# Altium schematic sheet BatteryConn&Protection.SchDoc
size A; DocumentNumber: 3; SheetNumber: 3; SheetTotal: 7
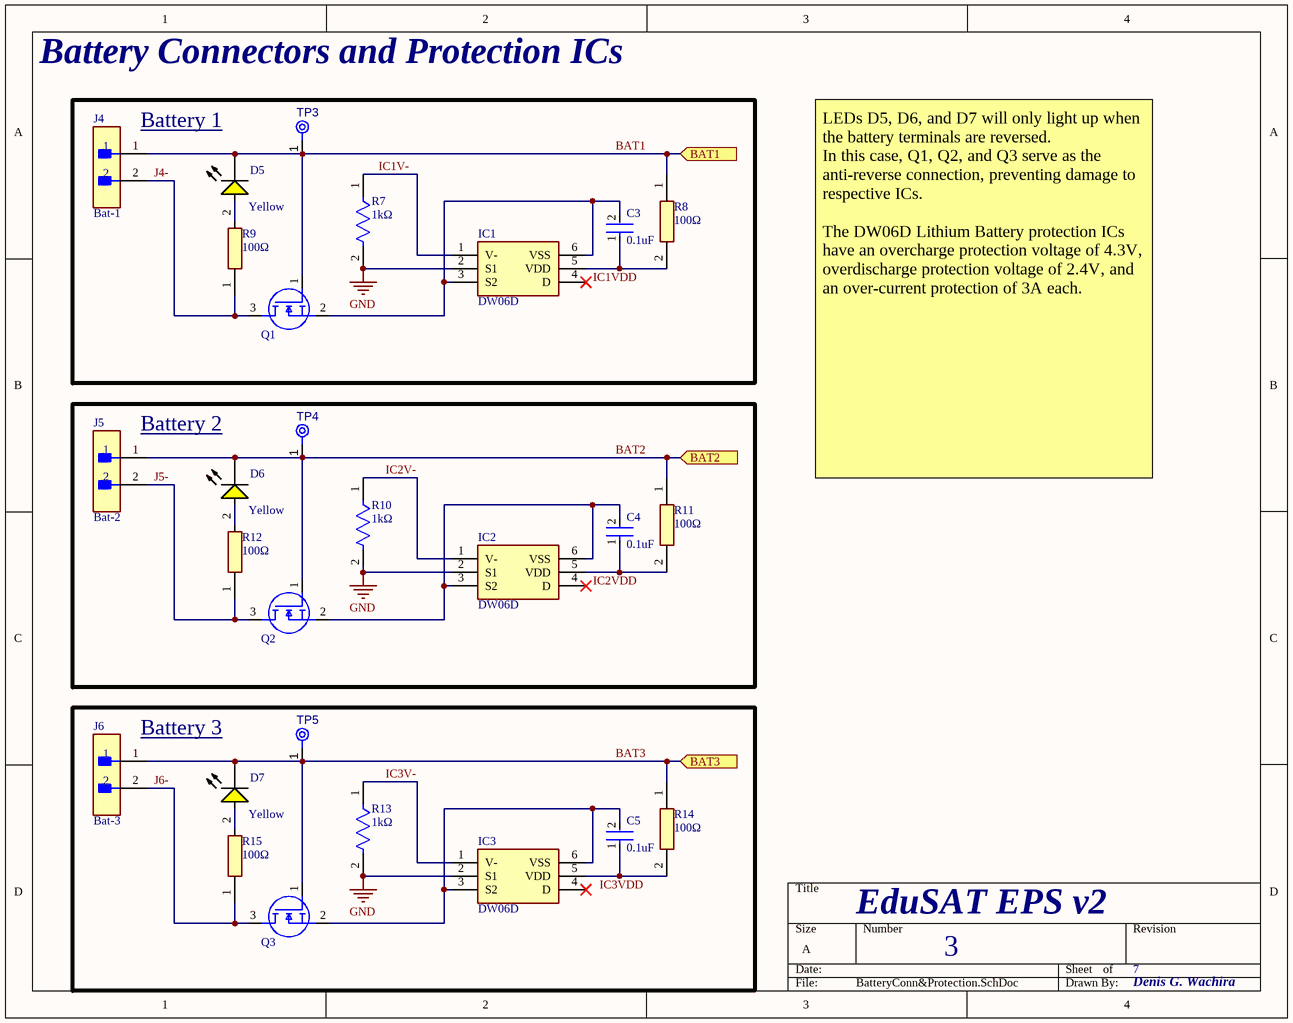
[diagram p0: BatteryConn&Protection.SchDoc]

## Parts
C3  0.1uF  [FP-CL21-IPC_A]
C4  0.1uF  [FP-CL21-IPC_A]
C5  0.1uF  [FP-CL21-IPC_A]
D5  Yellow  [LTST-C170KSKT_V]
D6  Yellow  [LTST-C170KSKT_V]
D7  Yellow  [LTST-C170KSKT_V]
IC1  DW06D  [SOT95P280X135-6N]
IC2  DW06D  [SOT95P280X135-6N]
IC3  DW06D  [SOT95P280X135-6N]
J4  Bat-1  [FP-S2B-XH-A-1_LF_SN-MFG]
J5  Bat-2  [FP-S2B-XH-A-1_LF_SN-MFG]
J6  Bat-3  [FP-S2B-XH-A-1_LF_SN-MFG]
Q1  (no value)  [SOT95P237X112-3N]
Q2  (no value)  [SOT95P237X112-3N]
Q3  (no value)  [SOT95P237X112-3N]
R7  1kΩ  [FP-MCR10-IPC_A]
R8  100Ω  [RESC2012X65N]
R9  100Ω  [RESC2012X65N]
R10  1kΩ  [FP-MCR10-IPC_A]
R11  100Ω  [RESC2012X65N]
R12  100Ω  [RESC2012X65N]
R13  1kΩ  [FP-MCR10-IPC_A]
R14  100Ω  [RESC2012X65N]
R15  100Ω  [RESC2012X65N]
TP3  TPAD6R  [TP06R]  (value not drawn)  (no BOM)
TP4  TPAD6R  [TP06R]  (value not drawn)  (no BOM)
TP5  TPAD6R  [TP06R]  (value not drawn)  (no BOM)

## Blocks framed on the sheet
Battery 1: C3 D5 IC1 J4 Q1 R7-R9 TP3
Battery 2: C4 D6 IC2 J5 Q2 R10-R12 TP4
Battery 3: C5 D7 IC3 J6 Q3 R13-R15 TP5

## Ports
BAT1 (in, see EduSAT-EPSv2[3B], Charging&1AOut1[4B]), BAT2 (in, see EduSAT-EPSv2[3C], Charging&1AOut2[4B]), BAT3 (in, see EduSAT-EPSv2[3C], Charging&1AOut3[4B])

## Nets
GND: IC1.2(S1) IC2.2(S1) IC3.2(S1) R7.2 R10.2 R13.2
BAT1: D5.2(K) J4.1 Q1.1(G) R8.1 TP3.1(TP) ; port BAT1
BAT2: D6.2(K) J5.1 Q2.1(G) R11.1 TP4.1(TP) ; port BAT2
BAT3: D7.2(K) J6.1 Q3.1(G) R14.1 TP5.1(TP) ; port BAT3
IC1V-: IC1.1(V-) R7.1
IC1VDD: C3.1 IC1.5(VDD) R8.2
IC2V-: IC2.1(V-) R10.1
IC2VDD: C4.1 IC2.5(VDD) R11.2
IC3V-: IC3.1(V-) R13.1
IC3VDD: C5.1 IC3.5(VDD) R14.2
J4-: J4.2 Q1.3(D) R9.1
J5-: J5.2 Q2.3(D) R12.1
J6-: J6.2 Q3.3(D) R15.1
NetC3_2: C3.2 IC1.3(S2) IC1.6(VSS) Q1.2(S)
NetC4_2: C4.2 IC2.3(S2) IC2.6(VSS) Q2.2(S)
NetC5_2: C5.2 IC3.3(S2) IC3.6(VSS) Q3.2(S)
NetD5_1: D5.1(A) R9.2
NetD6_1: D6.1(A) R12.2
NetD7_1: D7.1(A) R15.2

Not connected (* = marked no-connect by the designer): IC1 4(D)*; IC2 4(D)*; IC3 4(D)*

## Notes on the sheet
- Battery Connectors and Protection ICs
- LEDs D5, D6, and D7 will only light up when the battery terminals are reversed.
  In this case, Q1, Q2, and Q3 serve as the anti-reverse connection, preventing damage to respective ICs.
  The DW06D Lithium Battery protection ICs have an overcharge protection voltage of 4.3V, overdischarge protection voltage of 2.4V, and an over-current protection of 3A each.
- EduSAT EPS v2
- Denis G. Wachira

## Library data of the parts
C3-C5 = CMP-13271-002975-1: 50V 0.1uF X7R ±10% 0805 Multilayer Ceramic Capacitors MLCC - SMD/SMT ROHS TCC0805X7R104K500DT; Case Code (Imperial): 0805; Length: 2mm; Case/Package: 0805; Packaging: Tape and Reel; Width: 0.049inch; Tolerance: 10%; Mount: Surface Mount; Min Operating Temperature: -55°C; Thickness: 0.057inch; Height: 1.25mm; Dielectric: X7R; Package Quantity: 1; Depth: 1.25mm; Capacitance: 0.1uF; Voltage Rating: 50V; Case Code (Metric): 2012; Max Operating Temperature: 85°C; Radiation Hardening: No
D5-D7 = CMP-2000-06621-1: LED Yellow, 75 mW, 80 mA, -55 to 85 degC, 2-Pin SMD, RoHS, Tape and Reel KT-0805Y; Manufacturer: Lite-On; Main Category: ChipLED; Product Depth (mm): 1.25mm; Dominant Wave Length: 587nm; Viewing Angle: 130deg; Luminous Intensity: 112mcd; Test Current (It): 20mA; Emitting Color: Amber; Chip Material: AlGaInP; Product Height (mm): 1.1mm; Forward Voltage: 2.4V; High Brightness: Yes; Forward Current: 30mA; Number of  Elements: 1; Power Dissipation: 75W; Type: Uni-Color; Shape Type: Rectangular; Peak Wavelength: 588nm; Reverse Voltage: 5V; Rad Hardened: No; Product Length (mm): 2mm; DELETED: Compliant; Package Description: 2-Pin Surface Mount Device, Body 2 x 1.25 mm; Mounting: SurfaceMount; Lum Intensity: 112mcd; Pin Count: 2; Mounting Technology: SurfaceMount; Package Reference: C170KSKT; Datasheet Version: Rev. H, 04/2014; Package Type: ChipLed; Packaging: TapeandReel; Manufacturer URL: http://www.us.liteon.com/; Datasheet URL: http://optoelectronics.liteon.com/upload/download/DS-22-99-0188/S_110_LTST-C170KSKT.pdf; Operating Temp Range: -55Cto85C; Lens Dimensions: 1.4x1.25x0.6mm; Operating Temperature Classification: Industrial
IC1-IC3 = DW06D: Integrated Circuit; Manufacturer_Name: SHEN ZHEN FINE MAD ELECTRONICS GROUP; Datasheet Link: https://datasheet.lcsc.com/szlcsc/Shenzhen-Fuman-Elec-DW06D_C82123.pdf; Height: 1.35mm; Manufacturer_Part_Number: DW06D
J4-J6 = CMP-17439-000260-1: CONN HEADER R/A 2POS 2.5MM HCZZ0139-2; Voltage Rating: 250V; Number of Positions: 2; Contact Material: Brass; Series: XH; Contact Finish - Mating: TIN; Max Operating Temperature: 85°C; Number of Rows: 1; Packaging: Bulk; Insulation Color: Natural; Lead Free: Lead Free; Fastening Type: Detent; Termination: Press-Fit; Connector Type: Header; Insulation Material: Nylon; Contact Shape: Square; Contact Type: Male Pin; Mount: Through Hole; Min Operating Temperature: -25°C; Flammability Rating: UL94 V-0
Q1-Q3 = IRLML6344TRPBF: MOSFET (N-Channel)IRLML6344TRPBF; Manufacturer_Name: Infineon; Datasheet Link: https://www.infineon.com/dgdl/irlml6344pbf.pdf?fileId=5546d462533600a4015356689c44262c; Height: 1.12mm; Manufacturer_Part_Number: IRLML6344TRPBF; Mouser Part Number: 942-IRLML6344TRPBF; Mouser Price/Stock: https://www.mouser.co.uk/ProductDetail/Infineon-Technologies/IRLML6344TRPBF?qs=9%252BKlkBgLFf2w4qS48UOXVw%3D%3D; Arrow Part Number: IRLML6344TRPBF; Arrow Price/Stock: https://www.arrow.com/en/products/irlml6344trpbf/infineon-technologies-ag?region=europe
R7 R10 R13 = CMP-08839-023103-1: Thick Film Chip Resistor, 0805, 1kΩ, 1%, 100ppm/°C, 0.125W, 150V 0805W8F1001T5E; Power Rating: 125mW; Resistance: 1kR; Max Operating Temperature: 155°C; Length: 0.079inch; Case/Package: 0805; Tolerance: 1%; Mount: Surface Mount; Packaging: Tape and Reel; Number of Terminations: 2; Voltage Rating (DC): 150V; RoHS Compliant: Yes; Case Code (Metric): 2012; Lead Free: Lead Free; Max Power Dissipation: 125mW; Height: 0.024inch; Temperature Coefficient: 100ppm/°C; Resistor Type: Thick Film; Case Code (Imperial): 0805; Package Quantity: 5000; Contact Plating: Tin; Width: 0.049inch; Min Operating Temperature: -55°C
R8 R9 = AECR0805F27R0K9: 125mW Thick Film Resistors 150V ±100ppm/℃ ±1% 100Ω 0805 Chip Resistor - Surface Mount ROHS AECR0805F100RK9; Manufacturer_Name: ResistorToday; Datasheet Link: https://datasheet.lcsc.com/lcsc/2304140030_RESI-AECR0805F27R0K9_C352233.pdf; Height: 0.65mm; Manufacturer_Part_Number: AECR0805F27R0K9
R11 R12 R14 R15 = AECR0805F27R0K9: 125mW Thick Film Resistors 150V ±100ppm/℃ ±1% 100Ω 0805 Chip Resistor - Surface Mount ROHSAECR0805F100RK9; Manufacturer_Name: ResistorToday; Datasheet Link: https://datasheet.lcsc.com/lcsc/2304140030_RESI-AECR0805F27R0K9_C352233.pdf; Height: 0.65mm; Manufacturer_Part_Number: AECR0805F27R0K9
TP3-TP5 = CMP-00028-00002-2: 0.6mm round; Pins: 1